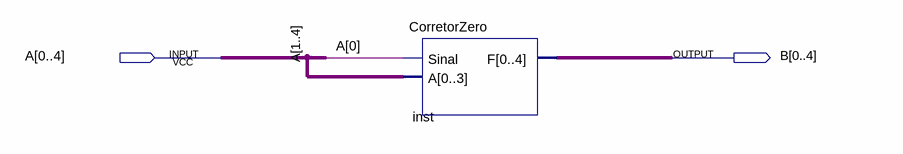
[diagram p0: schematic sheet]
// Quartus schematic CorretorZeroCompact.bdf as structural Verilog: 1 symbols, 2 pins
module CorretorZeroCompact (
  input  [0:4] A,
  output [0:4] B
);

  CorretorZero inst (.Sinal(A[0]), .A(A[1:4]), .F(B));
endmodule
